# EAGLE schematic IoT7egment (EAGLE 7.1.0)
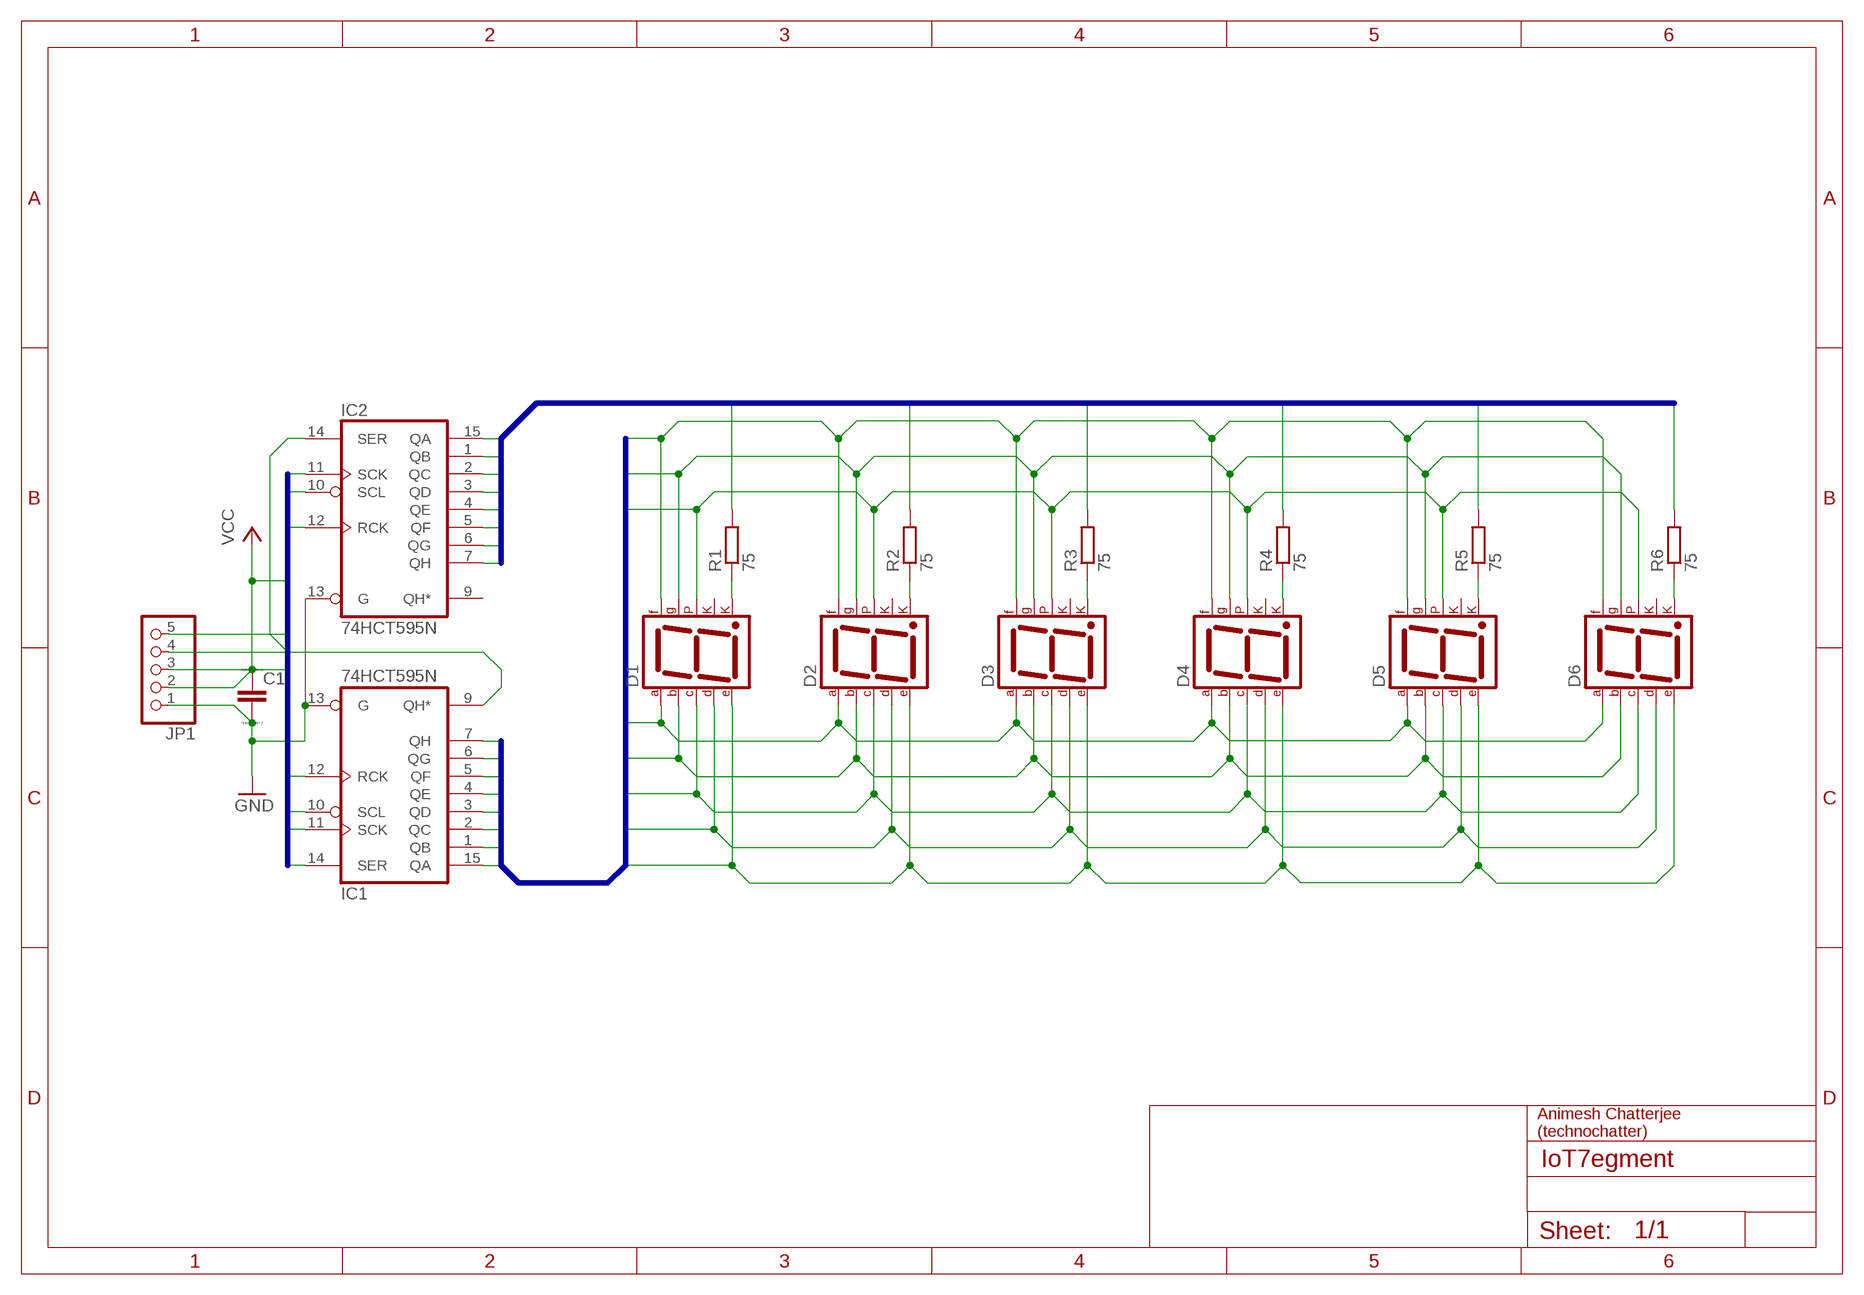
[diagram p0: schematic, sheet 1]

## Parts
C1  C  [C0805]
D1  7SEG-CK  [7SEG-13]
D2  7SEG-CK  [7SEG-13]
D3  7SEG-CK  [7SEG-13]
D4  7SEG-CK  [7SEG-13]
D5  7SEG-CK  [7SEG-13]
D6  7SEG-CK  [7SEG-13]
IC1  74HCT595N  [DIL16]
IC2  74HCT595N  [DIL16]
JP1  PINHD-1X5  [1X05]
R1  75  R-EU_0207/15  [0207/15]
R2  75  R-EU_0207/15  [0207/15]
R3  75  R-EU_0207/12  [0207/12]
R4  75  R-EU_0207/12  [0207/12]
R5  75  R-EU_0207/10  [0207/10]
R6  75  R-EU_0207/10  [0207/10]

## Nets
DIG0: IC2.15(QA) R1.2
DIG1: IC2.1(QB) R2.2
DIG2: IC2.2(QC) R3.2
DIG3: IC2.3(QD) R4.2
DIG4: IC2.4(QE) R5.2
DIG5: IC2.5(QF) R6.2
DIG6: IC2.6(QG)
DIG7: IC2.7(QH)
GND: C1.2 IC1.13(G) IC2.13(G) JP1.1
N$1: IC1.9(QH*) IC2.14(SER)
N$2: D3.8(CK2) R3.1
N$3: D2.8(CK2) R2.1
N$5: D4.8(CK2) R4.1
N$6: D5.8(CK2) R5.1
N$7: D6.8(CK2) R6.1
N$11: D1.8(CK2) R1.1
SEG0: D1.1(E) D2.1(E) D3.1(E) D4.1(E) D5.1(E) D6.1(E) IC1.15(QA)
SEG1: D1.5(DP) D2.5(DP) D3.5(DP) D4.5(DP) D5.5(DP) D6.5(DP) IC1.1(QB)
SEG2: D1.2(D) D2.2(D) D3.2(D) D4.2(D) D5.2(D) D6.2(D) IC1.2(QC)
SEG3: D1.4(C) D2.4(C) D3.4(C) D4.4(C) D5.4(C) D6.4(C) IC1.3(QD)
SEG4: D1.10(G) D2.10(G) D3.10(G) D4.10(G) D5.10(G) D6.10(G) IC1.4(QE)
SEG5: D1.7(A) D2.7(A) D3.7(A) D4.7(A) D5.7(A) D6.7(A) IC1.5(QF)
SEG6: D1.9(F) D2.9(F) D3.9(F) D4.9(F) D5.9(F) D6.9(F) IC1.6(QG)
SEG7: D1.6(B) D2.6(B) D3.6(B) D4.6(B) D5.6(B) D6.6(B) IC1.7(QH)
SER0: IC1.11(SCK) IC2.11(SCK) JP1.3
SER1: IC1.14(SER) JP1.4
SER2: IC1.12(RCK) IC2.12(RCK) JP1.5
SER3: C1.1 IC1.10(SCL) IC2.10(SCL) JP1.2 ; supply symbol labelled VCC
Unconnected: D1.3(CK1) D2.3(CK1) D3.3(CK1) D4.3(CK1) D5.3(CK1) D6.3(CK1) IC2.9(QH*)

## Buses
SEG[0..7]
DIG[0..7]
SER[0..3]

## Notes on the sheet
- Animesh Chatterjee
  (technochatter)

## Power pins joined to a net without a drawn wire
GND: IC1.8(GND) IC2.8(GND)
VCC: IC1.16(VCC) IC2.16(VCC)

## Library data of the parts
C1 = eagle-ltspice:C: CAPACITOR, European symbol; SPICEMODEL: NONE; SPICEPREFIX: C
D1-D6 = special:7SEG-CK: 7-segment DISPLAY single cathode, 13 mm
IC1 IC2 = 74xx-eu:74*595: 8-bit SHIFT REGISTER, output latch
JP1 = pinhead:PINHD-1X5: PIN HEADER
R1-R6 = rcl:R-EU_: RESISTOR, European symbol